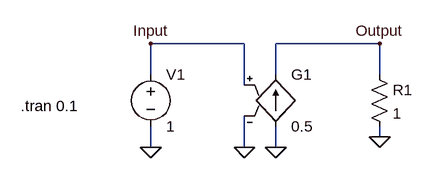
[diagram p0: schematic test_power_source (not finished).asc]
test_power_source (not finished).asc, the LTspice schematic file:
Version 4
SHEET 1 880 680
WIRE 304 80 160 80
WIRE 512 80 352 80
WIRE 160 128 160 80
WIRE 352 128 352 80
WIRE 512 128 512 80
WIRE 304 144 304 80
WIRE 512 224 512 208
WIRE 160 240 160 208
WIRE 304 240 304 192
WIRE 352 240 352 208
FLAG 160 240 0
FLAG 512 224 0
FLAG 304 240 0
FLAG 160 80 Input
FLAG 512 80 Output
FLAG 352 240 0
SYMBOL g 352 112 R0
SYMATTR InstName G1
SYMATTR Value 0.5
SYMBOL res 496 112 R0
SYMATTR InstName R1
SYMATTR Value 1
SYMBOL voltage 160 112 R0
SYMATTR InstName V1
SYMATTR Value 1
TEXT -40 176 Left 2 !.tran 0.1

The netlist it stands for:
* test_power_source (not finished).asc
G1 0 Output Input 0 0.5
R1 Output 0 1
V1 Input 0 1
.tran 0.1
.backanno
.end